# EAGLE design seismometer_lcdboard (EAGLE 7.0.0)
Placa Principal TGF-SIS001
AUTHOR: Ivan Pereira
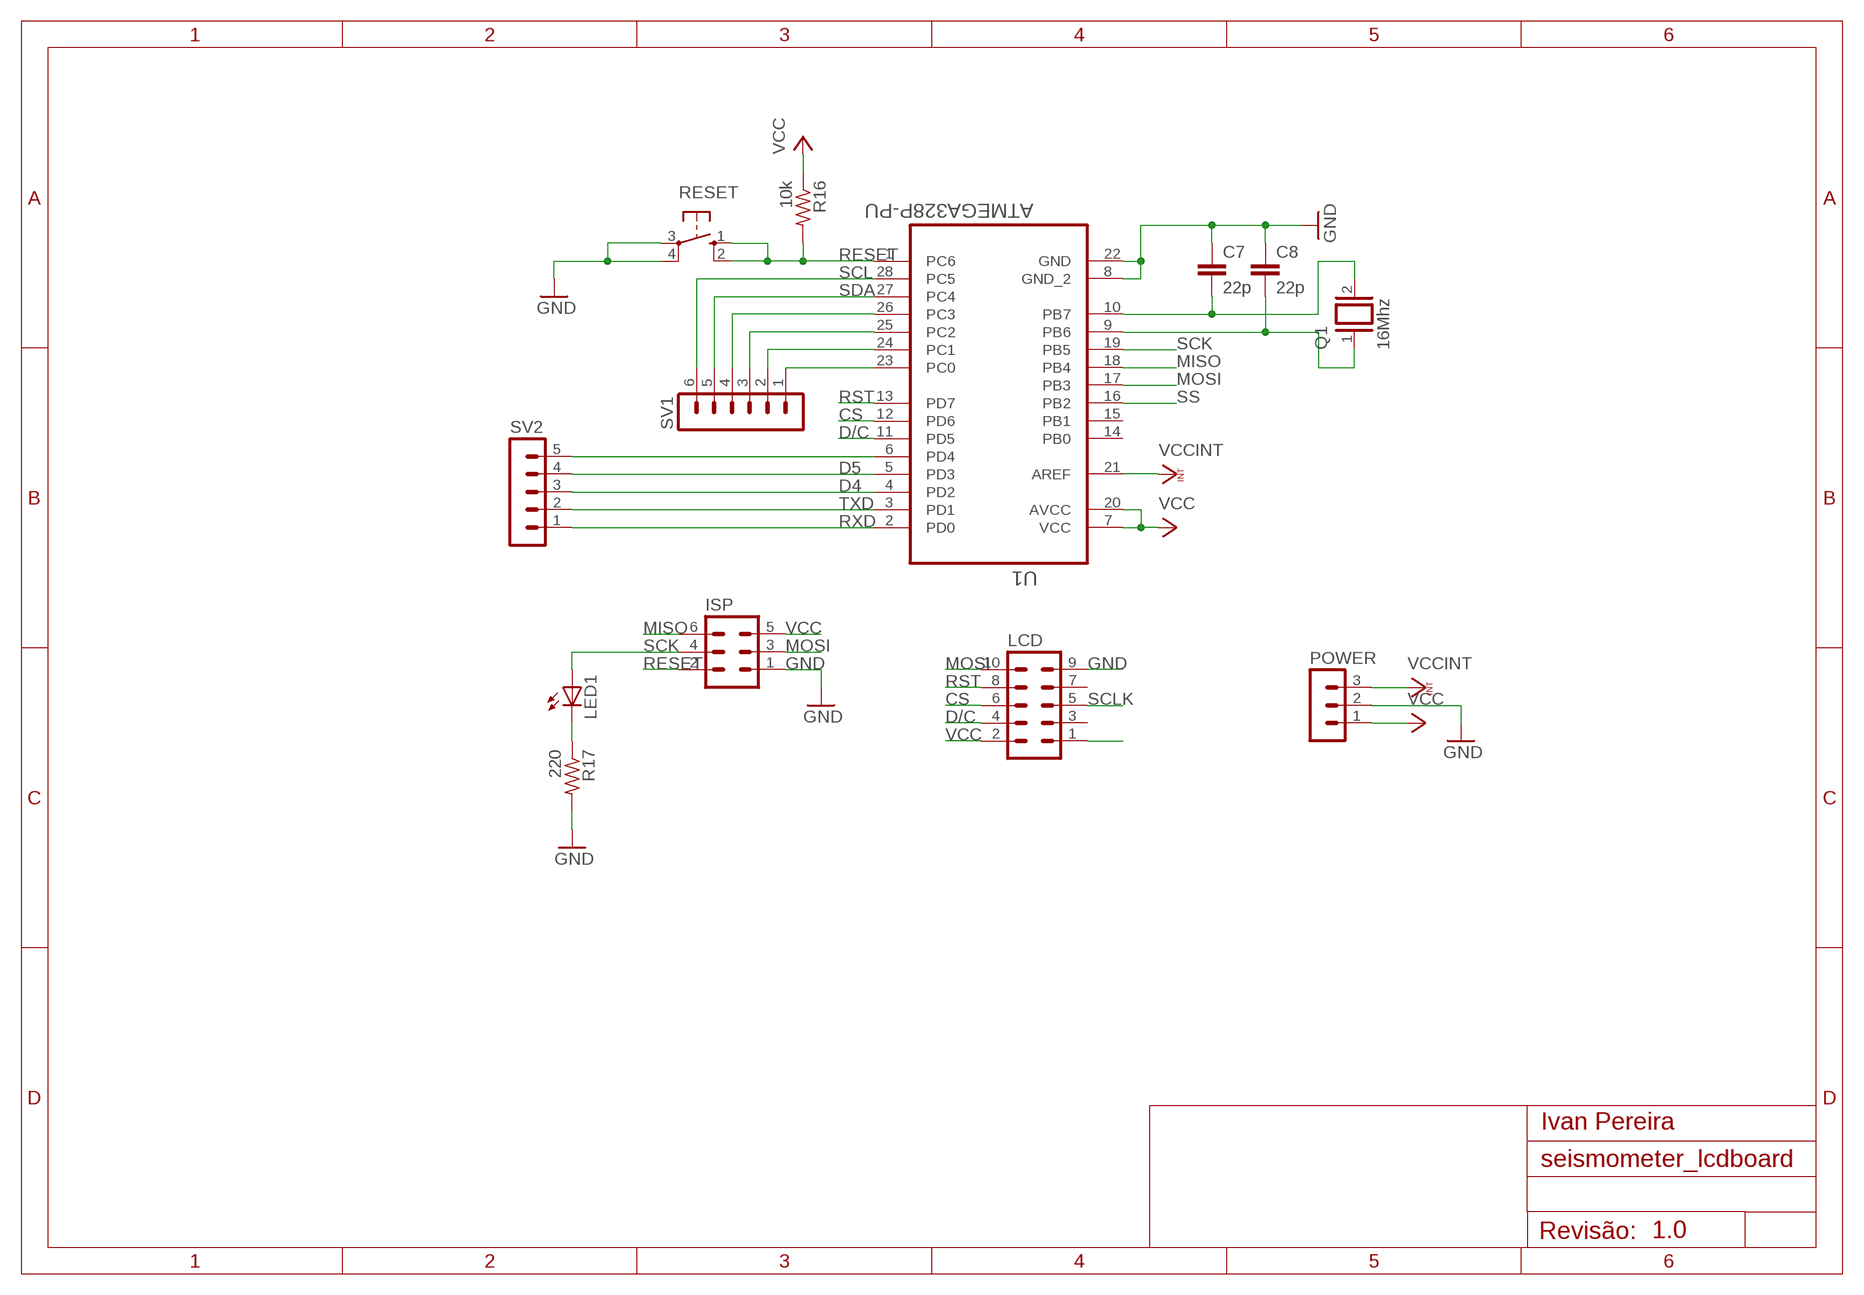
[diagram p0: schematic, sheet 1]
FRAME1 (A4L-LOC): AUTHOR: Ivan Pereira; REV: 1.0

## Parts
C7  22p  C-EU050-025X075  [C050-025X075]
C8  22p  C-EU050-025X075  [C050-025X075]
ISP  MA03-2  [MA03-2]
LCD  MA05-2  [MA05-2]
LED1  LED3MM  [LED3MM]
POWER  MA03-1  [MA03-1]
Q1  16Mhz  XTAL/S  [QS]
R16  10k  R-US_0207/12  [0207/12]
R17  220  R-US_0207/12  [0207/12]
RESET  10-XX  [B3F-10XX]
SV1  MA06-1  [MA06-1]
SV2  MA05-1  [MA05-1]
U1  ATMEGA328P-PU  [DIP254P762X457-28]

## Nets
CS: LCD.6 U1.12(PD6)
D4: SV2.3 U1.4(PD2)
D5: SV2.4 U1.5(PD3)
D/C: LCD.4 U1.11(PD5)
GND: C7.1 C8.1 ISP.1 LCD.9 POWER.2 R17.2 RESET.3(P) RESET.4(P1) U1.8(GND_2) U1.22(GND)
MISO: ISP.6 U1.18(PB4)
MOSI: ISP.3 LCD.10 U1.17(PB3)
N$1: SV1.1 U1.23(PC0)
N$2: LCD.1
N$3: SV1.2 U1.24(PC1)
N$4: SV1.3 U1.25(PC2)
N$5: SV1.4 U1.26(PC3)
N$6: SV2.5 U1.6(PD4)
N$22: C7.2 Q1.2 U1.10(PB7)
N$23: C8.2 Q1.1 U1.9(PB6)
N$31: LED1.K(C) R17.1
RESET: ISP.2 R16.2 RESET.1(S) RESET.2(S1) U1.1(PC6)
RST: LCD.8 U1.13(PD7)
RXD: SV2.1 U1.2(PD0)
SCK: ISP.4 LED1.A U1.19(PB5)
SCL: SV1.6 U1.28(PC5)
SCLK: LCD.5
SDA: SV1.5 U1.27(PC4)
SS: U1.16(PB2)
TXD: SV2.2 U1.3(PD1)
VCC: ISP.5 LCD.2 POWER.1 R16.1 U1.7(VCC) U1.20(AVCC)
VCCINT: POWER.3 U1.21(AREF)
Unconnected: LCD.3 LCD.7 U1.14(PB0) U1.15(PB1)

## Library data of the parts
C7 C8 = rcl:C-EU: CAPACITOR, European symbol
ISP = con-lstb:MA03-2: PIN HEADER; OC_FARNELL: unknown; OC_NEWARK: unknown
LCD = con-lstb:MA05-2: PIN HEADER; OC_FARNELL: unknown; OC_NEWARK: unknown
LED1 = adafruit:LED: LED OSRAM: - CHIPLED LG R971, LG N971, LY N971, LG Q971, LY Q971, LO R971, LY R971 LH N974, LH R974 LS Q976, LO Q976, LY Q976 LO Q996 - Hyper CHIPLED LW Q18S LB Q993, LB Q99A, LB R99A - SideLED LS A670, LO A670, LY A670, LG A670, LP A670 LB A673, LV A673, LT A673, LW A673 LH A674 LY A675 LS A676, LA A676, LO A676, LY A676, LW A676 LS A679, LY A679, LG A679 - Hyper Micro SIDELED® LS Y876, LA Y876, LO Y876, LY Y876 LT Y87S - SmartLED LW L88C, LW L88S LB L89C, LB L89S, LG L890 LS L89K, LO L89K, LY L89K LS L896, LA L896, LO L896, LY L896 - TOPLED LS T670, LO T670, LY T670, LG T670, LP T670 LSG T670, LSP T670, LSY T670, LOP T670, LYG T670 LG T671, LOG T671, LSG T671 LB T673, LV T673, LT T673, LW T673 LH T674 LS T676, LA T676, LO T676, LY T676, LB T676, LH T676, LSB T676, LW T676 LB T67C, LV T67C, LT T67C, LS T67K, LO T67K, LY T67K, LW E67C LS E67B, LA E67B, LO E67B, LY E67B, LB E67C, LV E67C, LT E67C LW T67C LS T679, LY T679, LG T679 LS T770, LO T770, LY T770, LG T770, LP T770 LB T773, LV T773, LT T773, LW T773 LH T774 LS E675, LA E675, LY E675, LS T675 LS T776, LA T776, LO T776, LY T776, LB T776 LHGB T686 LT T68C, LB T68C - Hyper Mini TOPLED® LB M676 - Mini TOPLED Santana® LG M470 LS M47K, LO M47K, LY M47K Source: http://www.osram.convergy.de/
POWER = con-lstb:MA03-1: PIN HEADER; OC_FARNELL: unknown; OC_NEWARK: unknown
Q1 = special:XTAL/S: CRYSTAL
R16 R17 = resistor:R-US_: RESISTOR, American symbol
RESET = switch-omron:10-XX: OMRON SWITCH; MPN: B3F-1000; OC_FARNELL: 176432; OC_NEWARK: 36M3542
SV1 = con-lstb:MA06-1: PIN HEADER; OC_FARNELL: unknown; OC_NEWARK: unknown
SV2 = con-lstb:MA05-1: PIN HEADER; OC_FARNELL: unknown; OC_NEWARK: unknown
U1 = Atmel_By_element14_Batch_1-00:ATMEGA328P-PU: 8-bit Microcontroller with In-System Programmable Flash; MPN: ATMEGA328P-PU; OC_FARNELL: 1715487; OC_NEWARK: 15R0268; PACKAGE: PDIP-28; SUPPLIER: Atmel

## Board
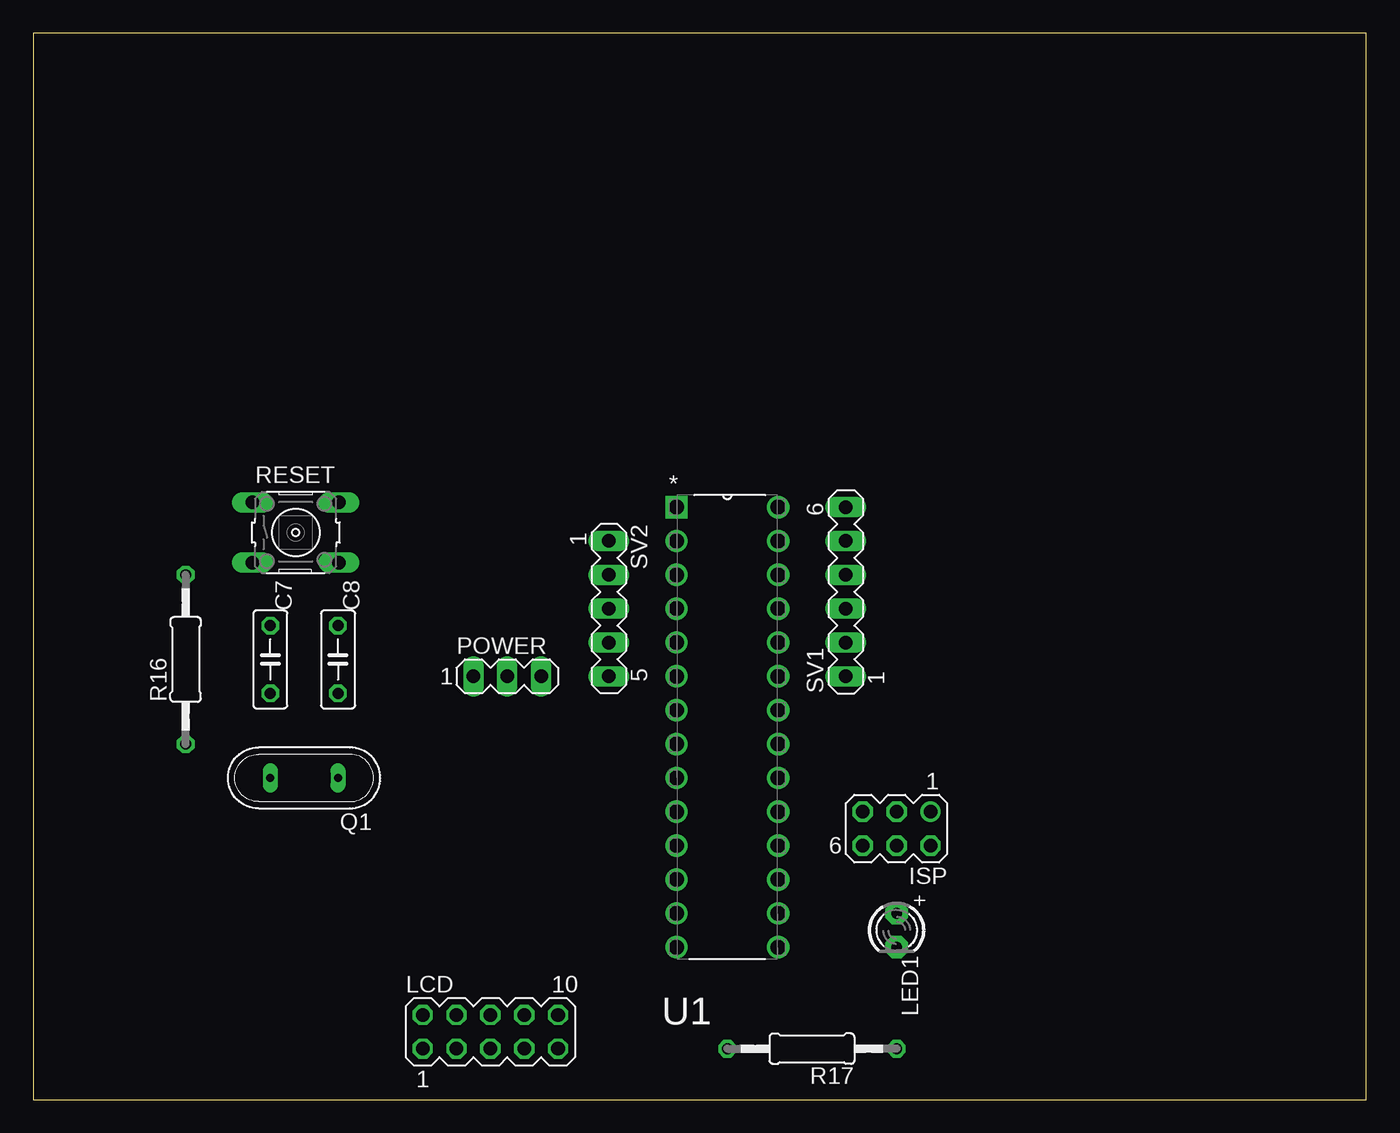
[diagram p1: board, top side]
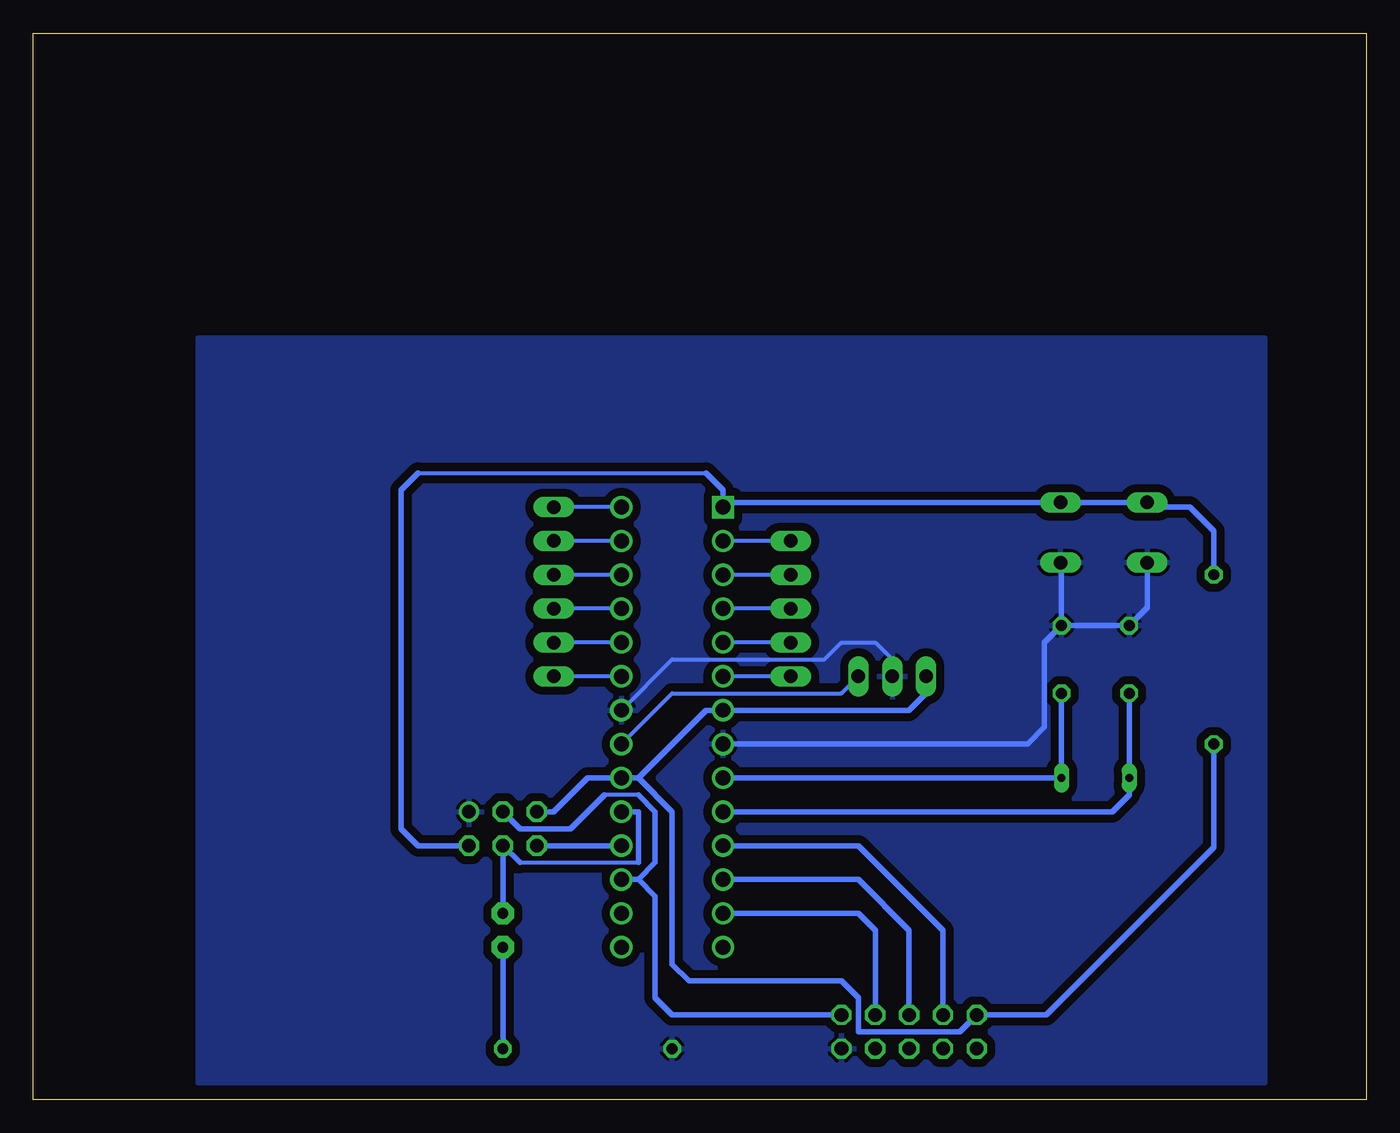
[diagram p2: board, bottom side, seen from below]

Size 100 x 80 mm. Coordinates in mm from the lower left corner, seen from the top.
Outline: 0,0 100,0 100,80 0,80 0,0
Copper layers (1*16): Top 0.035mm / dielectric 1.5mm / Bottom 0.035mm
Design rules "default": minimum track width 10mil, minimum drill 24mil, track to track 8mil, track to pad 8mil, pad to pad 8mil, via to via 8mil, smd to smd 8mil, copper to edge 40mil, drill to drill 8mil, minimum pad ring 10mil, minimum via ring 8mil, stop-mask expansion 4mil, vias tented up to drill 0mil, thermal gap 10mil

### Footprints (pad centres in the part's own frame; a part is rotated, then mirrored left to right if it is on the bottom)
C050-025X075 = drill 0.813 octagon: 1 -2.54,0; 2 2.54,0
MA03-2 = drill 1.016: 1 -2.54,-1.27 | drill 1.016 octagon: 2 -2.54,1.27; 3 0,-1.27; 4 0,1.27; 5 2.54,-1.27; 6 2.54,1.27
MA05-2 = drill 1.016 octagon: 1 -5.08,-1.27; 2 -5.08,1.27; 3 -2.54,-1.27; 4 -2.54,1.27; 5 0,-1.27; 6 0,1.27; 7 2.54,-1.27; 8 2.54,1.27; 9 5.08,-1.27; 10 5.08,1.27
LED3MM = drill 0.813 pad 1.676 octagon: A -1.27,0; K 1.27,0
MA03-1 = drill 1.016 long: 1 -2.54,0; 2 0,0; 3 2.54,0
QS = drill 0.61 long: 1 -2.54,0; 2 2.54,0
0207/12 = drill 0.813 octagon: 1 -6.35,0; 2 6.35,0
B3F-10XX = drill 1.016 long: 1 -3.251,2.261; 2 3.251,2.261; 3 -3.251,-2.261; 4 3.251,-2.261
MA06-1 = drill 1.016 long: 1 -6.35,0; 2 -3.81,0; 3 -1.27,0; 4 1.27,0; 5 3.81,0; 6 6.35,0
MA05-1 = drill 1.016 long: 1 -5.08,0; 2 -2.54,0; 3 0,0; 4 2.54,0; 5 5.08,0
DIP254P762X457-28 = drill 1.118 square: 1 -7.62,33.02 | drill 1.118: 2 -7.62,30.48; 3 -7.62,27.94; 4 -7.62,25.4; 5 -7.62,22.86; 6 -7.62,20.32; 7 -7.62,17.78; 8 -7.62,15.24; 9 -7.62,12.7; 10 -7.62,10.16; 11 -7.62,7.62; 12 -7.62,5.08; 13 -7.62,2.54; 14 -7.62,0; 15 0,0; 16 0,2.54; 17 0,5.08; 18 0,7.62; 19 0,10.16; 20 0,12.7; 21 0,15.24; 22 0,17.78; 23 0,20.32; 24 0,22.86; 25 0,25.4; 26 0,27.94; 27 0,30.48; 28 0,33.02

### Placement (x,y rotation side)
C7  17.78,33.02 270 top
C8  22.86,33.02 270 top
ISP  64.77,20.32 180 top
LCD  34.29,5.08 0 top
LED1  64.77,12.7 270 top
POWER  35.56,31.75 0 top
Q1  20.32,24.13 180 top
R16  11.43,33.02 90 top
R17  58.42,3.81 180 top
RESET  19.68,42.55 0 top
SV1  60.96,38.1 90 top
SV2  43.18,36.83 270 top
U1  55.88,11.43 0 top

### Tracks (layer width: path | path; a pad name or v marks a point on that pad's centre or on a via)
CS
  Bottom 0.406: U1.12 38.1,16.51 34.29,12.7 LCD.6
D4
  Bottom 0.305: SV2.3 U1.4
D5
  Bottom 0.305: SV2.4 U1.5
D/C
  Bottom 0.406: U1.11 38.1,19.05 31.75,12.7 LCD.4
GND
  Bottom 0.305: U1.22 52.07,33.02 40.64,33.02 39.37,34.29 36.83,34.29 35.56,33.02 POWER.2
  Bottom 0.406: C8.1 C7.1 16.43,36.91 RESET.3 | C8.1 22.86,40.21 RESET.4 | U1.8 25.4,26.67 24.13,27.94 24.13,34.29 C8.1
  pour Bottom (isolate 0.61): 7.62,1.27 7.62,57.15 87.63,57.15 87.63,1.27
MISO
  Bottom 0.406: U1.18 ISP.6
MOSI
  Bottom 0.305: 54.61,22.86 57.15,22.86
  Bottom 0.406: LCD.10 52.07,6.35 53.34,7.62 53.34,15.24 54.61,16.51 | U1.17 54.61,16.51 | 54.61,16.51 53.34,17.78 53.34,21.59 54.61,22.86 | 57.15,22.86 59.69,20.32 63.5,20.32 ISP.3
N$1
  Bottom 0.305: U1.23 SV1.1
N$3
  Bottom 0.305: U1.24 SV1.2
N$4
  Bottom 0.305: U1.25 SV1.3
N$5
  Bottom 0.305: U1.26 SV1.4
N$6
  Bottom 0.305: SV2.5 U1.6
N$22
  Bottom 0.406: U1.10 19.05,21.59 17.78,22.86 Q1.2 C7.2
N$23
  Bottom 0.406: U1.9 Q1.1 C8.2
N$31
  Bottom 0.406: LED1.K R17.1
RESET
  Bottom 0.305: 71.12,46.99 49.53,46.99
  Bottom 0.406: R16.2 11.43,42.65 13.23,44.45 16.08,44.45 RESET.1 RESET.2 47.9,44.81 U1.1 48.26,45.72 49.53,46.99 | ISP.2 71.12,19.05 72.39,20.32 72.39,45.72 71.12,46.99
RST
  Bottom 0.406: LCD.8 36.83,12.7 38.1,13.97 U1.13
RXD
  Bottom 0.305: SV2.1 U1.2
SCK
  Bottom 0.305: 63.5,17.78 54.61,17.78
  Bottom 0.406: LED1.A ISP.4 63.5,17.78 | 54.61,17.78 54.61,21.59 U1.19
SCL
  Bottom 0.305: U1.28 SV1.6
SDA
  Bottom 0.305: U1.27 SV1.5
TXD
  Bottom 0.305: SV2.2 U1.3
VCC
  Bottom 0.406: 54.61,24.13 49.53,29.21 U1.7 34.29,29.21 33.02,30.48 POWER.1 | 54.61,24.13 U1.20 58.42,24.13 60.96,21.59 ISP.5 | R16.1 11.43,18.92 24,6.35 LCD.2 30.48,5.08 38.1,5.08 38.1,7.62 39.37,8.89 50.8,8.89 52.07,10.16 52.07,21.59 54.61,24.13
VCCINT
  Bottom 0.305: U1.21 52.07,30.48 39.37,30.48 POWER.3